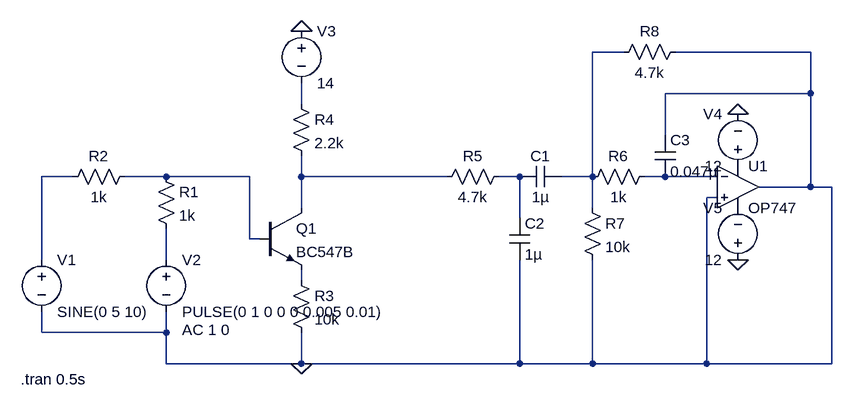
[diagram p0: schematic sampling gen reconstruction.asc]
sampling gen reconstruction.asc, the LTspice schematic file:
Version 4
SHEET 1 1348 680
WIRE 1024 -256 976 -256
WIRE 1312 -256 1104 -256
WIRE 1312 -192 1312 -256
WIRE 1312 -192 1088 -192
WIRE 528 -176 528 -208
WIRE 1088 -128 1088 -192
WIRE 176 -64 128 -64
WIRE 320 -64 256 -64
WIRE 448 -64 320 -64
WIRE 528 -64 528 -96
WIRE 752 -64 528 -64
WIRE 864 -64 832 -64
WIRE 976 -64 976 -256
WIRE 976 -64 928 -64
WIRE 1088 -64 1056 -64
WIRE 1168 -64 1088 -64
WIRE 1312 -48 1312 -192
WIRE 1312 -48 1232 -48
WIRE 1344 -48 1312 -48
WIRE 1168 -32 1152 -32
WIRE 528 -16 528 -64
WIRE 976 -16 976 -64
WIRE 864 0 864 -64
WIRE 448 32 448 -64
WIRE 464 32 448 32
WIRE 128 64 128 -64
WIRE 320 64 320 16
WIRE 528 96 528 80
WIRE 128 176 128 144
WIRE 320 176 320 144
WIRE 320 176 128 176
WIRE 320 224 320 176
WIRE 528 224 528 176
WIRE 528 224 320 224
WIRE 864 224 864 64
WIRE 864 224 528 224
WIRE 976 224 976 64
WIRE 976 224 864 224
WIRE 1152 224 1152 -32
WIRE 1152 224 976 224
WIRE 1344 224 1344 -48
WIRE 1344 224 1152 224
FLAG 528 -288 0
FLAG 528 224 0
FLAG 1200 -160 0
FLAG 1200 64 0
SYMBOL voltage 128 48 R0
WINDOW 123 0 0 Left 0
WINDOW 39 0 0 Left 0
SYMATTR InstName V1
SYMATTR Value SINE(0 5 10)
SYMBOL voltage 320 48 R0
WINDOW 123 24 124 Left 2
WINDOW 39 0 0 Left 0
SYMATTR Value2 AC 1 0
SYMATTR InstName V2
SYMATTR Value PULSE(0 1 0 0 0 0.005 0.01)
SYMBOL res 304 -80 R0
SYMATTR InstName R1
SYMATTR Value 1k
SYMBOL res 272 -80 R90
WINDOW 0 0 56 VBottom 2
WINDOW 3 32 56 VTop 2
SYMATTR InstName R2
SYMATTR Value 1k
SYMBOL npn 464 -16 R0
SYMATTR InstName Q1
SYMATTR Value BC547B
SYMBOL res 512 80 R0
SYMATTR InstName R3
SYMATTR Value 10k
SYMBOL res 512 -192 R0
SYMATTR InstName R4
SYMATTR Value 2.2k
SYMBOL voltage 528 -304 R0
WINDOW 123 0 0 Left 0
WINDOW 39 0 0 Left 0
SYMATTR InstName V3
SYMATTR Value 14
SYMBOL res 848 -80 R90
WINDOW 0 0 56 VBottom 2
WINDOW 3 32 56 VTop 2
SYMATTR InstName R5
SYMATTR Value 4.7k
SYMBOL res 1072 -80 R90
WINDOW 0 0 56 VBottom 2
WINDOW 3 32 56 VTop 2
SYMATTR InstName R6
SYMATTR Value 1k
SYMBOL cap 928 -80 R90
WINDOW 0 0 32 VBottom 2
WINDOW 3 32 32 VTop 2
SYMATTR InstName C1
SYMATTR Value 1µ
SYMBOL cap 848 0 R0
SYMATTR InstName C2
SYMATTR Value 1µ
SYMBOL res 960 -32 R0
SYMATTR InstName R7
SYMATTR Value 10k
SYMBOL OpAmps\\OP747 1200 -112 R0
SYMATTR InstName U1
SYMBOL voltage 1200 -64 R180
WINDOW 0 24 96 Left 2
WINDOW 3 24 16 Left 2
WINDOW 123 0 0 Left 0
WINDOW 39 0 0 Left 0
SYMATTR InstName V4
SYMATTR Value 12
SYMBOL voltage 1200 80 R180
WINDOW 0 24 96 Left 2
WINDOW 3 24 16 Left 2
WINDOW 123 0 0 Left 0
WINDOW 39 0 0 Left 0
SYMATTR InstName V5
SYMATTR Value 12
SYMBOL cap 1072 -128 R0
SYMATTR InstName C3
SYMATTR Value 0.047µ
SYMBOL res 1120 -272 R90
WINDOW 0 0 56 VBottom 2
WINDOW 3 32 56 VTop 2
SYMATTR InstName R8
SYMATTR Value 4.7k
TEXT 96 248 Left 2 !.tran 0.5s

The netlist it stands for:
* sampling gen reconstruction.asc
V1 N003 0 SINE(0 5 10)
V2 N008 0 PULSE(0 1 0 0 0 0.005 0.01) AC 1 0
R1 N004 N008 1k
R2 N004 N003 1k
Q1 N005 N004 N009 0 BC547B
R3 N009 0 10k
R4 N002 N005 2.2k
V3 0 N002 14
R5 N006 N005 4.7k
R6 N007 N001 1k
C1 N001 N006 1µ
C2 N006 0 1µ
R7 N001 0 10k
XU1 0 N007 P001 P002 0 OP747  ; pins In+ In- V+ V- OUT
V4 P001 0 12
V5 0 P002 12
C3 0 N007 0.047µ
R8 0 N001 4.7k
.model NPN NPN
.model PNP PNP
.lib standard.bjt
.tran 0.5s
.backanno
.end